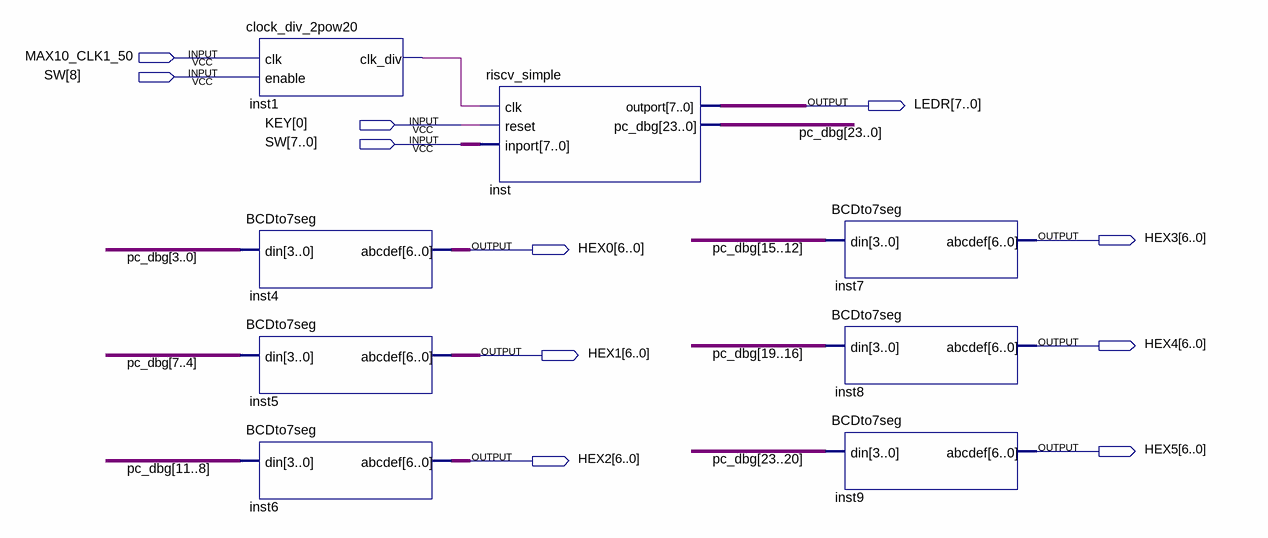
[diagram p0: schematic sheet]
// Quartus schematic risvc_top.bdf as structural Verilog: 8 symbols, 11 pins
module risvc_top (
  input  MAX10_CLK1_50,
  input  [8:0] SW,
  input  [0:0] KEY,
  output [7:0] LEDR,
  output [6:0] HEX3,
  output [6:0] HEX0,
  output [6:0] HEX4,
  output [6:0] HEX1,
  output [6:0] HEX5,
  output [6:0] HEX2
);

  wire inst1_clk_div;
  wire [23:0] pc_dbg;

  clock_div_2pow20 inst1 (.clk(MAX10_CLK1_50), .enable(SW[8]), .clk_div(inst1_clk_div));
  BCDto7seg inst4 (.din(pc_dbg[3:0]), .abcdef(HEX0));
  BCDto7seg inst5 (.din(pc_dbg[7:4]), .abcdef(HEX1));
  BCDto7seg inst6 (.din(pc_dbg[11:8]), .abcdef(HEX2));
  riscv_simple inst (.clk(inst1_clk_div), .reset(KEY[0]), .inport(SW[7:0]), .outport(LEDR), .pc_dbg(pc_dbg));
  BCDto7seg inst7 (.din(pc_dbg[15:12]), .abcdef(HEX3));
  BCDto7seg inst8 (.din(pc_dbg[19:16]), .abcdef(HEX4));
  BCDto7seg inst9 (.din(pc_dbg[23:20]), .abcdef(HEX5));
endmodule
